# Altium schematic sheet Sheet1.SchDoc
size 420 x 297 mm; Organization: ФЕЛ, ДК-91; DocumentNumber: 1; SheetNumber: 1; SheetTotal: 1
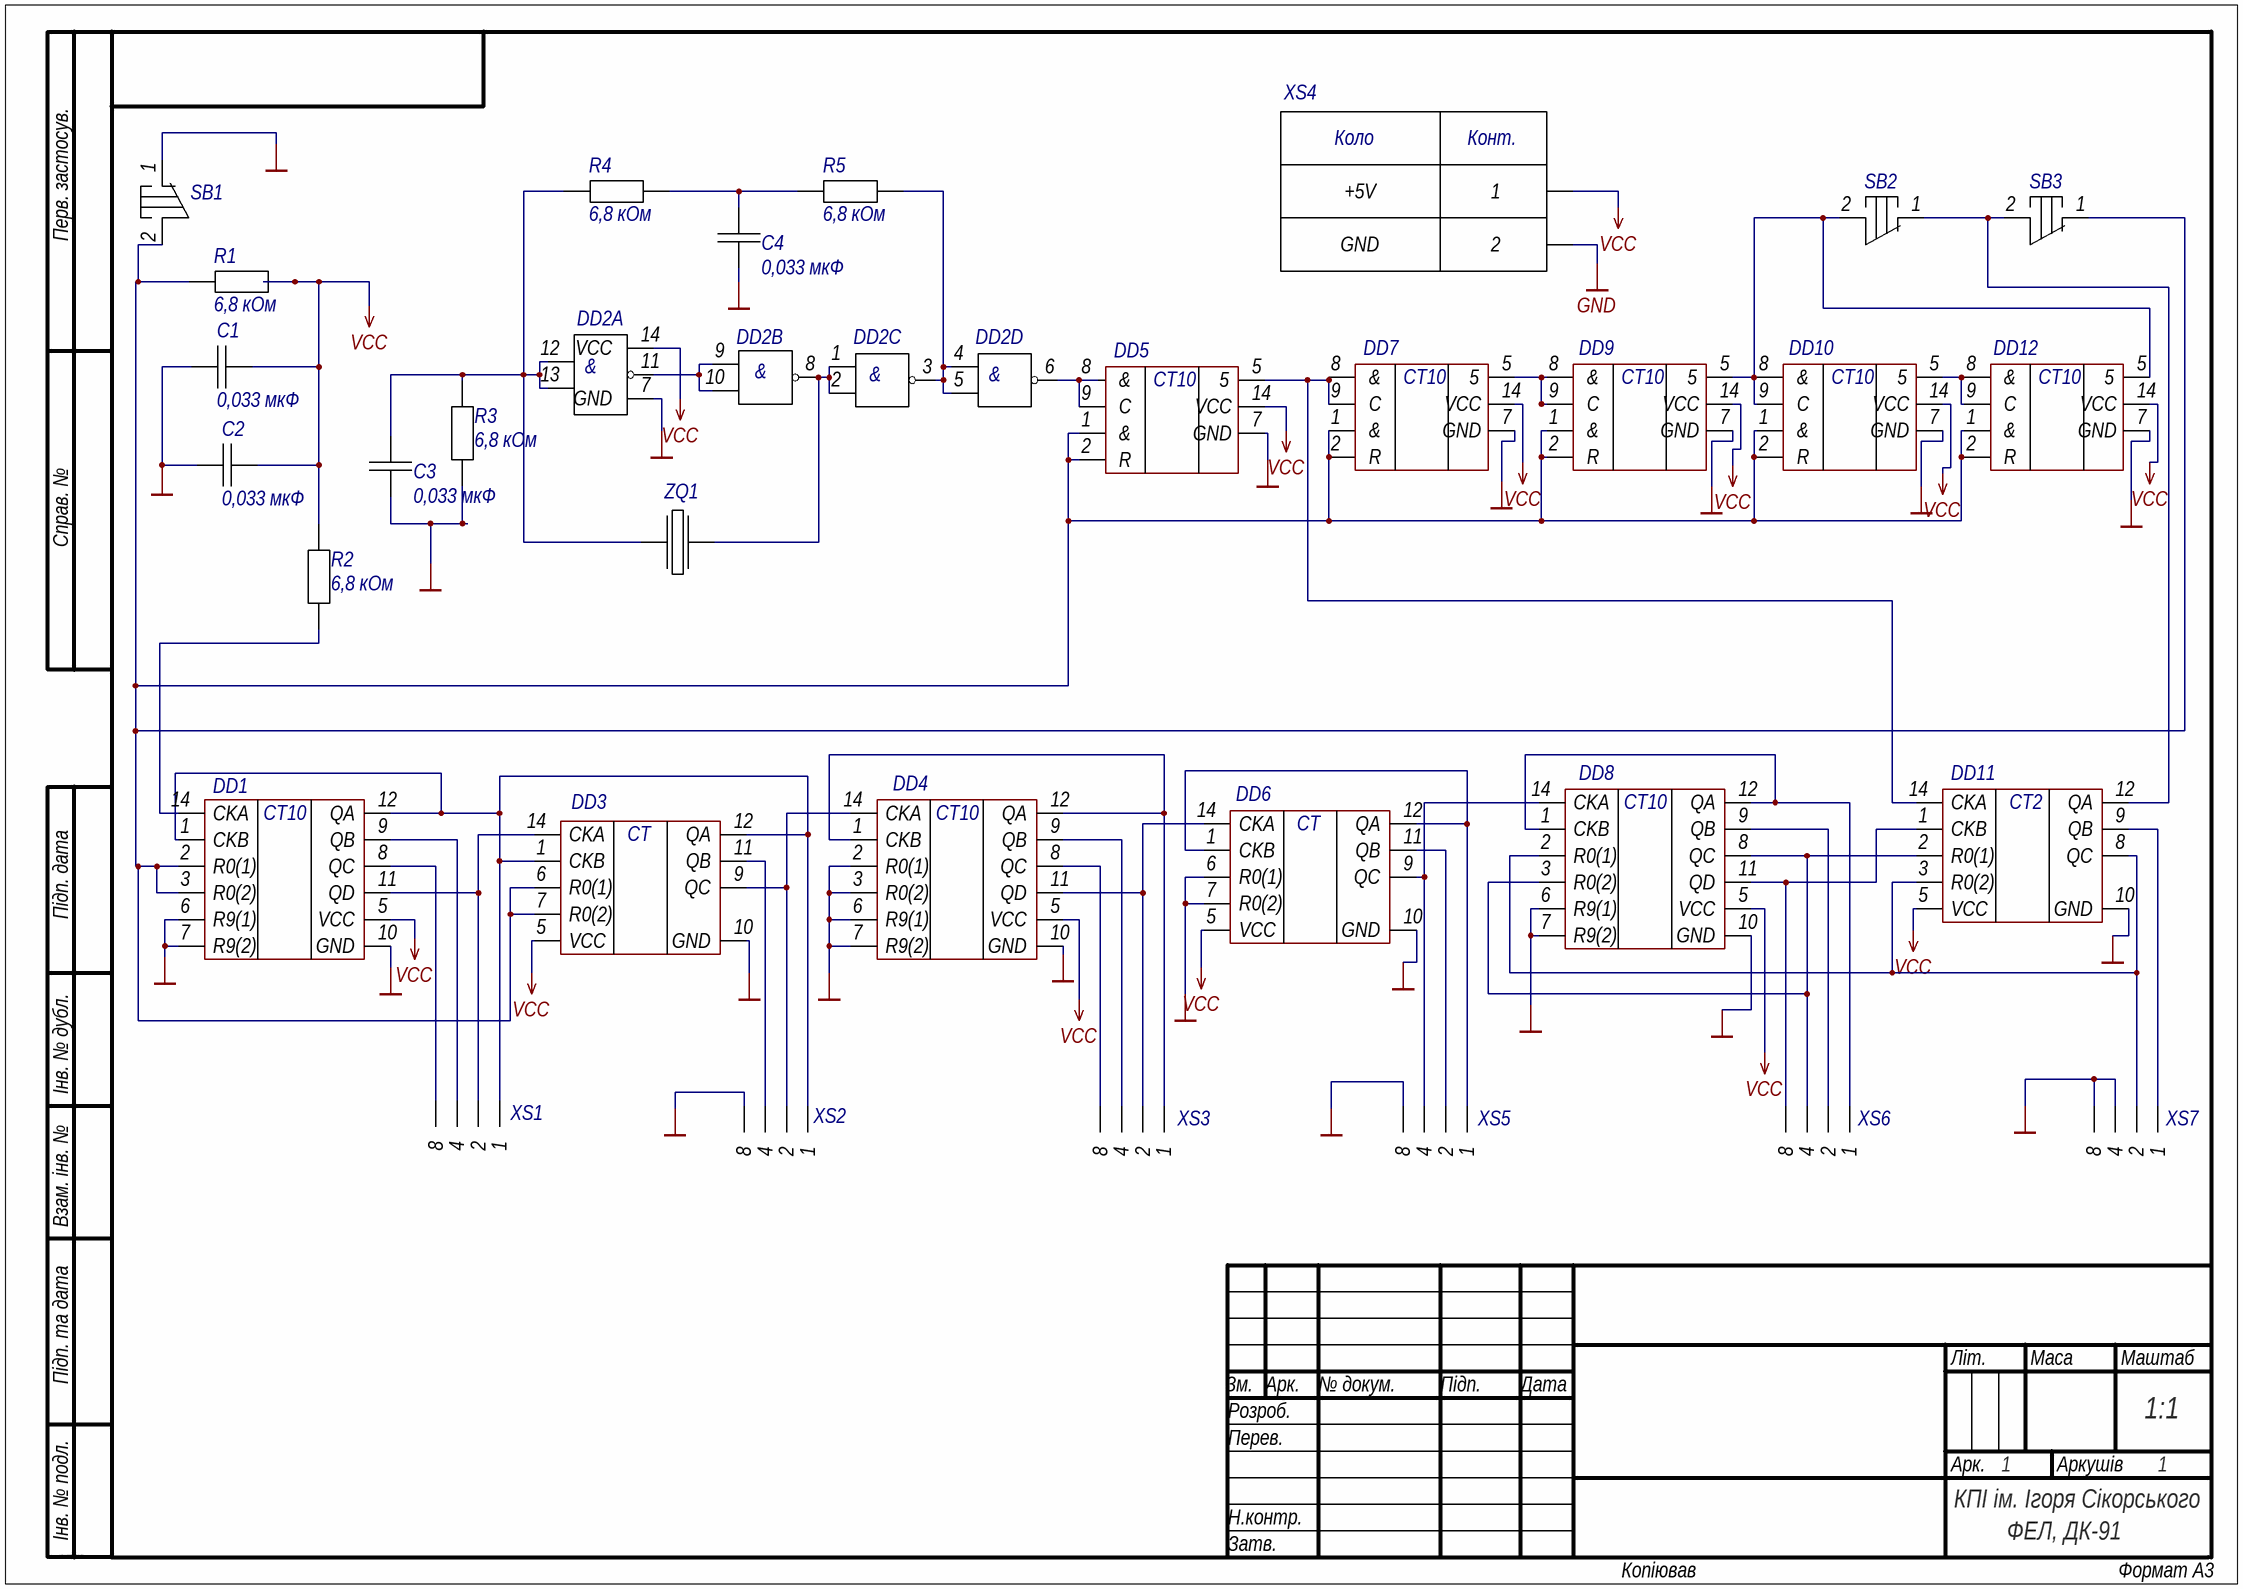
[diagram p0: Sheet1.SchDoc]

## Parts
C1  value 0,033 мкФ  [C0805]  (hidden comment: C-0805 16 В 0,033 мкФ 5% X5R Jiayang)
C2  value 0,033 мкФ  [C0805]  (hidden comment: C-0805 16 В 0,033 мкФ 5% X5R Jiayang)
C3  value 0,033 мкФ  [C0805]  (hidden comment: C-0805 16 В 91 мкФ 5% X5R Jiayang)
C4  value 0,033 мкФ  [C0805]  (hidden comment: C-0805 16 В 0,047 мкФ 5% X5R Jiayang)
DD1  SN7490A Texas Instruments  [SN7490A]  (value not drawn)
DD2  CD4011 Texas Instruments  [CD4011]  (value not drawn)  (parts A,B,C,D of 4)
DD3  SN7492A Texas Instruments  [SN7492A]  (value not drawn)
DD4  SN7490A Texas Instruments  [SN7490A]  (value not drawn)
DD5  K155ИЕ1 Ukraine  [К155ИЕ1]  (value not drawn)
DD6  SN7492A Texas Instruments  [SN7492A]  (value not drawn)
DD7  K155ИЕ1 Ukraine  [К155ИЕ1]  (value not drawn)
DD8  SN7490A Texas Instruments  [SN7490A]  (value not drawn)
DD9  K155ИЕ1 Ukraine  [К155ИЕ1]  (value not drawn)
DD10  K155ИЕ1 Ukraine  [К155ИЕ1]  (value not drawn)
DD11  SN7493 Texas Instruments  [SN7493]  (value not drawn)
DD12  K155ИЕ1 Ukraine  [К155ИЕ1]  (value not drawn)
R1  value 6,8 кОм  [R0805]  (hidden comment: R-0805 0,125 Вт 6,8 кОм 5% Vishay)
R2  value 6,8 кОм  [R0805]  (hidden comment: R-0805 0,125 Вт 6,8 кОм 5% Vishay)
R3  value 6,8 кОм  [R0805]  (hidden comment: R-0805 0,125 Вт 2 кОм 5% Vishay)
R4  value 6,8 кОм  [R0805]  (hidden comment: R-0805 0,125 Вт 2 кОм 5% Vishay)
R5  value 6,8 кОм  [R0805]  (hidden comment: R-0805 0,125 Вт 2 кОм 5% Vishay)
SB1  TS3611-2.5-180-B KLS  [SWITCH]  (value not drawn)
SB2  TS3611-2.5-180-B KLS  [SWITCH]  (value not drawn)
SB3  TS3611-2.5-180-B KLS  [SWITCH]  (value not drawn)
XS1  Pins  [Pins]  (value not drawn)
XS2  Pins  [Pins]  (value not drawn)
XS3  Pins  [Pins]  (value not drawn)
XS4  Power  [Power]  (value not drawn)
XS5  Pins  [Pins]  (value not drawn)
XS6  Pins  [Pins]  (value not drawn)
XS7  Pins  [Pins]  (value not drawn)
ZQ1  SIT1579AC-J3-33E-0001.000000 SiTime  [Quartz]  (value not drawn)

## Nets
GND: C1.2 C2.2 C3.2 C4.2 DD1.6(R9(1)) DD1.7(R9(2)) DD1.10(GND) DD2.7(GND) DD3.10(GND) DD4.2(R0(1)) DD4.3(R0(2)) DD4.6(R9(1)) DD4.7(R9(2)) DD4.10(GND) DD5.7(GND) DD6.6(R0(1)) DD6.7(R0(2)) DD6.10(GND) DD7.7(GND) DD8.6(R9(1)) DD8.7(R9(2)) DD8.10(GND) DD9.7(GND) DD10.7(GND) DD11.10(GND) DD12.7(GND) R3.1 SB1.1 XS2.4(8) XS4.2 XS5.4(8) XS7.3(4) XS7.4(8)
VCC: C1.1 C2.1 DD1.5(VCC) DD2.14(VCC) DD3.5(VCC) DD4.5(VCC) DD5.14(VCC) DD6.5(VCC) DD7.14(VCC) DD8.5(VCC) DD9.14(VCC) DD10.14(VCC) DD11.5(VCC) DD12.14(VCC) R1.2 R2.1 XS4.1
NetC3_1: C3.1 DD2.12 DD2.13 R3.2 R4.2 ZQ1.1
NetC4_1: C4.1 R4.1 R5.2
NetDD1_1: DD1.1(CKB) DD1.12(QA) DD3.1(CKB) DD3.12(QA) XS1.1 XS2.1
NetDD1_2: DD1.2(R0(1)) DD1.3(R0(2)) DD3.6(R0(1)) DD3.7(R0(2)) DD5.1(&) DD5.2(R) DD7.1(&) DD7.2(R) DD9.1(&) DD9.2(R) DD10.1(&) DD10.2(R) DD12.1(&) DD12.2(R) R1.1 SB1.2 SB3.1
NetDD1_8: DD1.8(QC) XS1.4(8)
NetDD1_9: DD1.9(QB) XS1.3(4)
NetDD1_11: DD1.11(QD) DD3.14(CKA) XS1.2
NetDD1_14: DD1.14(CKA) R2.2
NetDD2_1: DD2.1 DD2.2 DD2.8 ZQ1.2
NetDD2_3: DD2.3 DD2.4 DD2.5 R5.1
NetDD2_6: DD2.6 DD5.8(&) DD5.9(C)
NetDD2_9: DD2.9 DD2.10 DD2.11
NetDD3_9: DD3.9(QC) DD4.14(CKA) XS2.2
NetDD3_11: DD3.11(QB) XS2.3(4)
NetDD4_1: DD4.1(CKB) DD4.12(QA) XS3.1
NetDD4_8: DD4.8(QC) XS3.4(8)
NetDD4_9: DD4.9(QB) XS3.3(4)
NetDD4_11: DD4.11(QD) DD6.14(CKA) XS3.2
NetDD5_5: DD5.5 DD7.8(&) DD7.9(C) DD11.14(CKA)
NetDD6_1: DD6.1(CKB) DD6.12(QA) XS5.1
NetDD6_9: DD6.9(QC) DD8.14(CKA) XS5.3(4)
NetDD6_11: DD6.11(QB) XS5.2
NetDD7_5: DD7.5 DD9.8(&) DD9.9(C)
NetDD8_1: DD8.1(CKB) DD8.12(QA) XS6.1
NetDD8_2: DD8.2(R0(1)) DD11.3(R0(2)) DD11.8(QC) XS7.2
NetDD8_3: DD8.3(R0(2)) DD8.8(QC) DD11.2(R0(1)) XS6.3(4)
NetDD8_9: DD8.9(QB) XS6.2
NetDD8_11: DD8.11(QD) DD11.1(CKB) XS6.4(8)
NetDD9_5: DD9.5 DD10.8(&) DD10.9(C) DD12.5 SB2.2
NetDD10_5: DD10.5 DD12.8(&) DD12.9(C)
NetDD11_9: DD11.9(QB) XS7.1
NetDD11_12: DD11.12(QA) SB2.1 SB3.2

## Notes on the sheet
- Перв. застосув.
- Справ. №
- Підп. дата
- Інв. № дубл.
- Взам. інв. №
- Підп. та дата
- Зм.
- Розроб.
- Арк.
- № докум.
- Підп.
- Дата
- Літ.
- Маса
- Маштаб
- 1:1
- Перев.
- Аркушів
- Інв. № подл.
- Н.контр.
- Затв.
- КПІ ім. Ігоря Сікорського
- ALTIUM GOSTBOM2.0 KEV
- Копіював
- Формат А3
- (in symbol CD4011, part A) &
- (in symbol CD4011, part B) &
- (in symbol CD4011, part C) &
- (in symbol CD4011, part D) &
- (in symbol Power) Коло; Конт.; +5V; GND
- (in symbol SN7490A) СТ10
- (in symbol SN7492A) СТ
- (in symbol SN7493) СТ2
- (in symbol К155ИЕ1) CT10

## Library data of the parts
C1-C4 = C0805: Voltage: 16 В; Package: C-0805; Tolerance: 5%; Manufacturer: Jiayang; Temp_Coef: X5R
DD1 DD4 DD8 = SN7490A: Name: SN7490A; Manufacturer: Texas Instruments
DD2 = CD4011: Name: CD4011; Manufacturer: Texas Instruments; Parameter 1: *; Parameter 2: *
DD3 DD6 = SN7492A: Name: SN7492A; Manufacturer: Texas Instruments
DD5 DD7 DD9 DD10 DD12 = К155ИЕ1: Name: K155ИЕ1; Manufacturer: Ukraine
DD11 = SN7493: Name: SN7493; Manufacturer: Texas Instruments
R1-R5 = R0805: Packege: R-0805; Power: 0,125 Вт; Tolerance: 5%; Manufacturer: Vishay
SB1-SB3 = SWITCH: Name: TS3611-2.5-180-B; Manufacturer: KLS
ZQ1 = Quartz: Value: 1kHz; Voltage: 3.3V; Manufacturer: SiTime; Name: SIT1579AC-J3-33E-0001.000000